# Altium schematic sheet can.SchDoc
size A4; SheetNumber: 3; SheetTotal: 6
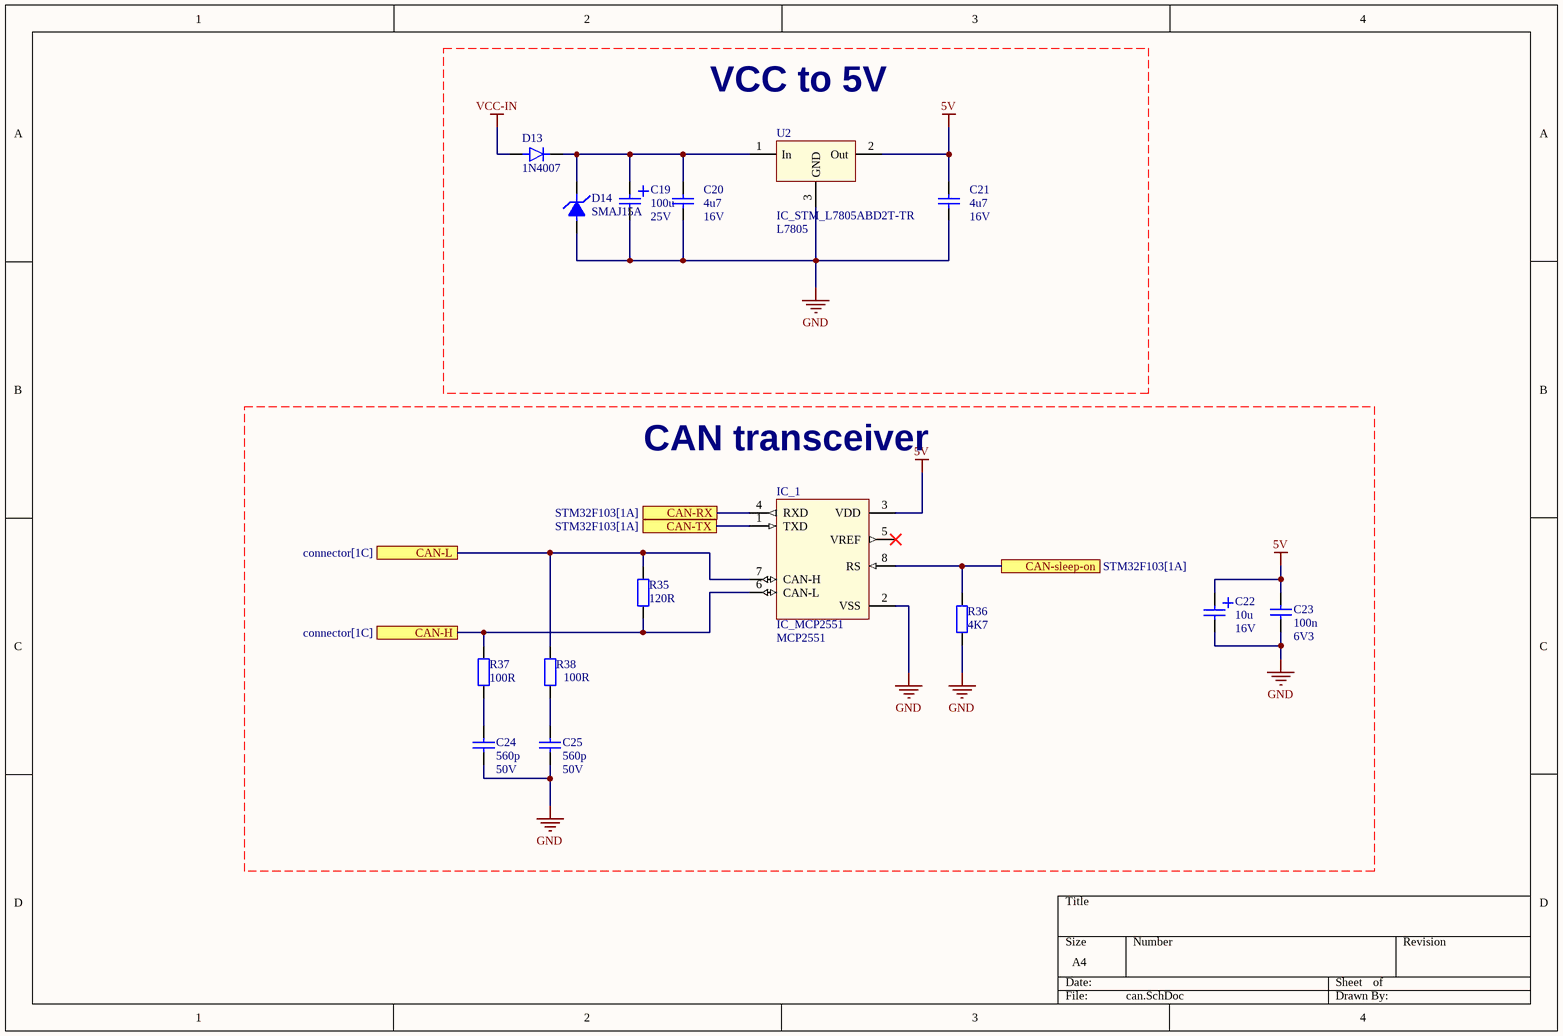
[diagram p0: can.SchDoc]

## Parts
C19  Value1: 100u  Value2: 25V  [CAPAE9983X102N]  (hidden comment: CAP_POL)
C20  Value1: 4u7  Value2: 16V  [CAPC2012X140N]  (hidden comment: CAP)
C21  Value1: 4u7  Value2: 16V  [CAPC2012X140N]  (hidden comment: CAP)
C22  Value1: 10u  Value2: 16V  [CAPAE430X550N]  (hidden comment: CAP_POL)
C23  Value1: 100n  Value2: 6V3  [CAPC2012X88N]  (hidden comment: CAP)
C24  Value1: 560p  Value2: 50V  [CAPC2012X88N]  (hidden comment: CAP)
C25  Value1: 560p  Value2: 50V  [CAPC2012X88N]  (hidden comment: CAP)
D13  Value1: 1N4007  [DO-214AC]  (hidden comment: DIO)
D14  Value1: SMAJ15A  [DO-214AC]  (hidden comment: DIO_UNIDIRECTIONAL_TVS)
IC_1  IC_MCP2551  Value1: MCP2551  [SOIC-8N]
R35  Value1: 120R  [RESC2012X60N]  (hidden comment: RES)
R36  Value1: 4K7  [RESC2012X60N]  (hidden comment: RES)
R37  Value1: 100R  [RESC2012X60N]  (hidden comment: RES)
R38  Value1: 100R  [RESC2012X60N]  (hidden comment: RES)
U2  IC_STM_L7805ABD2T-TR  Value1: L7805  [IC_STM_L7805ABD2T-TR]

## Ports
CAN-H (see connector[1C]), CAN-L (see connector[1C]), CAN-RX (see STM32F103[1A]), CAN-sleep-on (see STM32F103[1A]), CAN-TX (see STM32F103[1A])

## Nets
5V: C21.1 C22.1 C23.2 IC_1.3(VDD) U2.2(Out)
GND: C19.2 C20.2 C21.2 C22.2 C23.1 C24.1 C25.1 D14.1 IC_1.2(VSS) R36.1 U2.3(GND)
VCC-IN: D13.1(A)
CAN-H: IC_1.6(CAN-L) R35.1 R37.2 ; port CAN-H
CAN-L: IC_1.7(CAN-H) R35.2 R38.2 ; port CAN-L
CAN-RX: IC_1.4(RXD) ; port CAN-RX
CAN-sleep-on: IC_1.8(RS) R36.2 ; port CAN-sleep-on
CAN-TX: IC_1.1(TXD) ; port CAN-TX
NetC19_1: C19.1 C20.1 D13.2(K) D14.2 U2.1(In)
NetC24_2: C24.2 R37.1
NetC25_2: C25.2 R38.1

Not connected (* = marked no-connect by the designer): IC_1 5(VREF)*

## Notes on the sheet
- (near U2) VCC to 5V
- (near IC_1) CAN transceiver

## Library data of the parts
C19 = 01_01471: PANASONIC - EEEFC1E101AP - CAP, ALU ELEC, 100UF, 25V, SMD, REEL; AutoId: 1471; DeviceType: capacitor; SubType: Electrolyte; Id: 01_01471; Manufacturer: Panasonic; Manufacturer PN: EEEFC1E101AP; Status: 0 - Unchecked; MountType: SMD; ComponentLink1URL: X:\01_dataSheets\CAP_PANASONIC_EEUFCXXXXXX.pdf; Supplier 1: Farnell; Supplier Part Number 1: 2254349; ComponentLink1Description: Datasheet
C20 C21 = 01_01402: X7R 10% 0805; Manufacturer: MURATA; Manufacturer PN: GRM21BR71C475KA73L; AutoId: 1402; DeviceType: capacitor; SubType: Ceramic; Id: 01_01402; Status: 2 - Checked and Approved; MountType: SMD; ComponentLink1URL: X:\01_DataSheets\CAP_MURATA_GRM.pdf; Supplier 1: Farnell; Supplier Part Number 1: 1797015; ComponentLink1Description: Datasheet
C22 = 01_01399: ELCO 20%; Manufacturer: Nichicon; Manufacturer PN: UWF1C100MCL1GB; AutoId: 1399; DeviceType: capacitor; SubType: Electrolyte; Id: 01_01399; Status: 2 - Checked and Approved; MountType: SMT; ComponentLink1URL: X:\01_Datasheets\CAP_NICHICON_UWF1C100MCL1GB.pdf; Supplier 1: Farnell; Supplier Part Number 1: 647-UWF1C100MCL1GB; ComponentLink1Description: Datasheet
C23 = 01_00637: X7R 10% 0805; Manufacturer: KEMET; Manufacturer PN: C0805C104K9RACTU; AutoId: 637; DeviceType: capacitor; SubType: Ceramic; Id: 01_00637; Status: 2 - Checked and Approved; MountType: SMT; ComponentLink1URL: X:\01_Datasheets\CAP_KEMET_CxxxxCxxxXxRAC.pdf; Supplier 1: Farnell; Supplier Part Number 1: 80-C0805C104K9R; ComponentLink1Description: Datasheet
C24 C25 = 01_01464: YAGEO (PHYCOMP) - CC0805JRNPO9BN561 - CAP, MLCC, C0G/NP0, 560PF, 50V, 0805; AutoId: 1464; DeviceType: capacitor; SubType: Ceramic; Id: 01_01464; Manufacturer: YAGEO; Manufacturer PN: CC0805JRNPO9BN561; Status: 0 - Unchecked; MountType: SMD; ComponentLink1URL: X:\01_Datasheets\CAP_YAGEO_CC0805_NP0.pdf; Supplier 1: Farnell; Supplier Part Number 1: 718531; ComponentLink1Description: Datasheet
D13 = 03_00099: M7 Diode, max 30A; AutoId: 117; Value2: 1A, 400V; Id: 03_00099; Value3: M7; Manufacturer PN: 1N4007; DeviceType: diode; ComponentLink1Description: Datasheet; ComponentLink1URL: X:\01_Datasheets\; ComponentLink2Description: ComponentVerificationSheet; ComponentLink2URL: X:\02_ComponentVerificationSheets\
D14 = 03_00100: Transient Voltage Suppressors; Manufacturer: Littelfuse; AutoId: 118; Value2: 15Vr 400W 16.4A; Value3: TVS; DeviceType: diode; Id: 03_00100; Manufacturer PN: SMAJ15A; Status: 0 - Unchecked; MountType: SMD; ComponentLink1Description: Datasheet; ComponentLink1URL: X:\01_Datasheets\DIO_Littelfuse_SMAJ58A.pdf; ComponentLink2Description: ComponentVerificationSheet; ComponentLink2URL: X:\02_ComponentVerificationSheets\; Supplier Part Number 1: SMAJ15A
IC_1 = 07_00296: High-speed CAN transceiver; Manufacturer: Microchip; AutoId: 304; DeviceType: IC; Id: 07_00296; Manufacturer PN: MCP2551; Status: 0 - Unchecked; MountType: SMT; ComponentLink1Description: Datasheet; ComponentLink1URL: X:\01_Datasheets\mcp2551.pdf; ComponentLink2Description: ComponentVerificationSheet; ComponentLink2URL: X:\02_ComponentVerificationSheets\
R35 = 15_00318: RESISTOR, 0805, 120R, 1%, SMD; Manufacturer: Yageo; Manufacturer PN: RC0805FR-07120R; AutoId: 318; Value2: 0W125; SubType: Metal film; Id: 15_00318; DeviceType: resistor; Status: 2 - Checked and Approved; MountType: SMT; ComponentLink1Description: Datasheet; ComponentLink1URL: X:\01_Datasheets\RES_YAGEO_RC0805FR.pdf; Supplier 1: Farnell; Supplier Part Number 1: 9237372
R36 = 15_00337: RESISTOR, 0805, 4K7, 1%, SMD; Manufacturer: Yageo; Manufacturer PN: RC0805FR-074K7; AutoId: 337; Value2: 0W125; SubType: Metal film; Id: 15_00337; DeviceType: resistor; Status: 2 - Checked and Approved; MountType: SMT; ComponentLink1Description: Datasheet; ComponentLink1URL: X:\01_Datasheets\RES_YAGEO_RC0805FR.pdf; Supplier 1: Farnell; Supplier Part Number 1: 9237704
R37 R38 = 15_00317: RESISTOR, 0805, 100R, 1%, SMD; Manufacturer: Yageo; Manufacturer PN: RC0805FR-07100R; AutoId: 317; Value2: 0W125; SubType: Metal film; Id: 15_00317; DeviceType: resistor; Status: 2 - Checked and Approved; MountType: SMT; ComponentLink1Description: Datasheet; ComponentLink1URL: X:\01_Datasheets\RES_YAGEO_RC0805FR.pdf; Supplier 1: Farnell; Supplier Part Number 1: 9237364
U2 = 07_00226: Linear Voltage Regulators 5.0V 1.0A Positive; Manufacturer: STM; AutoId: 226; Value2: LDO; Id: 07_00226; Value3: LDO; Manufacturer PN: L7805ABD2T-TR; DeviceType: LDO; Status: 0 - Unchecked; MountType: SMT; ComponentLink1Description: Datasheet; ComponentLink1URL: X:\01_Datasheets\IC_STM_L7805ABD2T-TR.pdf; ComponentLink2Description: ComponentVerificationSheet; ComponentLink2URL: X:\02_ComponentVerificationSheets\; Supplier 1: Mouser; Supplier Part Number 1: 511-L7805ABD2T-TR